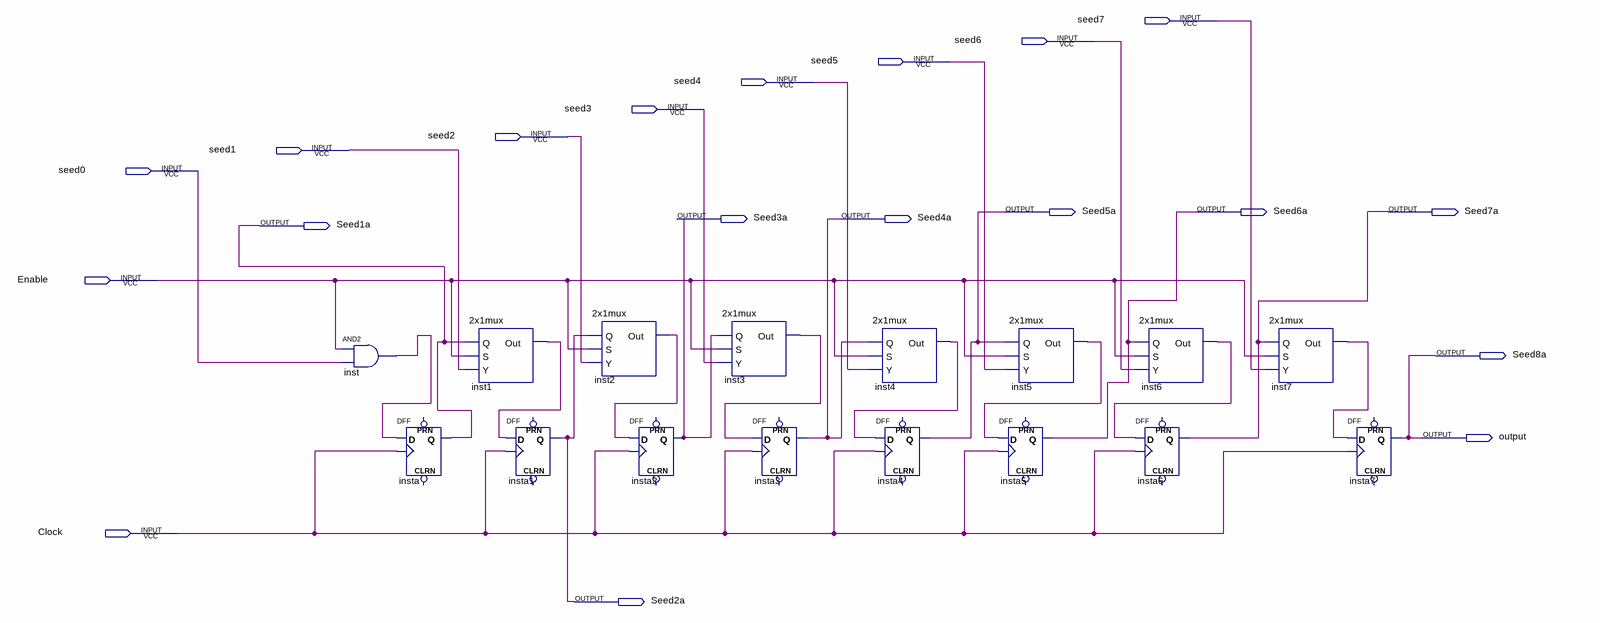
[diagram p0: schematic sheet]
// Quartus schematic 8-Bit-Shift.bdf as structural Verilog: 16 symbols, 19 pins
module \8-Bit-Shift  (
  input  seed7,
  input  seed6,
  input  seed5,
  input  seed4,
  input  seed3,
  input  seed2,
  input  seed1,
  input  seed0,
  input  Enable,
  input  Clock,
  output Seed5a,
  output Seed6a,
  output Seed7a,
  output Seed3a,
  output Seed4a,
  output Seed1a,
  output Seed8a,
  output \output ,
  output Seed2a
);

  wire inst1_out, inst2_out, inst3_out, inst4_out, inst5_out, inst6_out, inst7_out, inst_out;

  and inst (inst_out, Enable, seed0);
  DFF insta (.CLK(Clock), .D(inst_out), .Q(Seed1a));  // open: CLRN, PRN
  \2x1mux  inst1 (.Q(Seed1a), .S(Enable), .Y(seed1), .Out(inst1_out));
  DFF insta1 (.CLK(Clock), .D(inst1_out), .Q(Seed2a));  // open: CLRN, PRN
  \2x1mux  inst2 (.Q(Seed2a), .S(Enable), .Y(seed2), .Out(inst2_out));
  DFF insta2 (.CLK(Clock), .D(inst2_out), .Q(Seed3a));  // open: CLRN, PRN
  \2x1mux  inst3 (.Q(Seed3a), .S(Enable), .Y(seed3), .Out(inst3_out));
  DFF insta3 (.CLK(Clock), .D(inst3_out), .Q(Seed4a));  // open: CLRN, PRN
  \2x1mux  inst4 (.Q(Seed4a), .S(Enable), .Y(seed4), .Out(inst4_out));
  DFF insta4 (.CLK(Clock), .D(inst4_out), .Q(Seed5a));  // open: CLRN, PRN
  \2x1mux  inst5 (.Q(Seed5a), .S(Enable), .Y(seed5), .Out(inst5_out));
  DFF insta5 (.CLK(Clock), .D(inst5_out), .Q(Seed6a));  // open: CLRN, PRN
  \2x1mux  inst6 (.Q(Seed6a), .S(Enable), .Y(seed6), .Out(inst6_out));
  DFF insta6 (.CLK(Clock), .D(inst6_out), .Q(Seed7a));  // open: CLRN, PRN
  \2x1mux  inst7 (.Q(Seed7a), .S(Enable), .Y(seed7), .Out(inst7_out));
  DFF insta7 (.CLK(Clock), .D(inst7_out), .Q(\output ));  // open: CLRN, PRN

  assign Seed8a = \output ;
endmodule
